# Altium project Base_logic_gate.PrjPcb
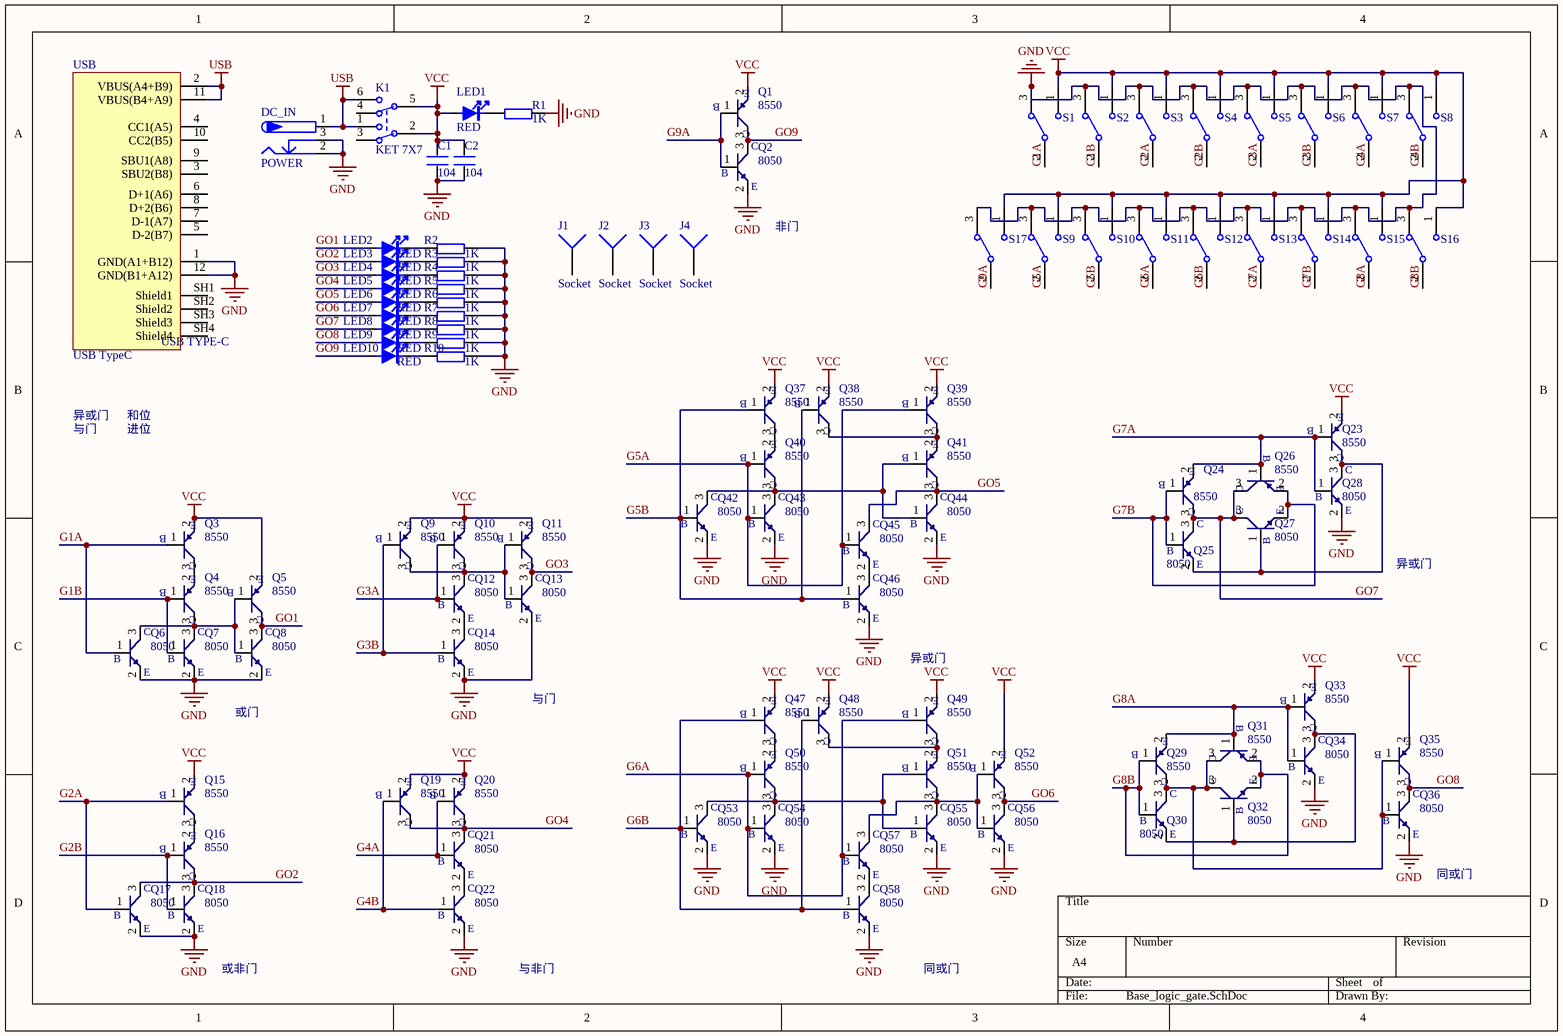
[diagram p0: Base_logic_gate.SchDoc]
1 sheet, 104 parts. Net scope: global (net labels, ports and power ports of the same name join across sheets).
Board file: Base_logic_gate.PcbDoc

## Sheet Base_logic_gate.SchDoc
size A4

### Parts
C1  104  [C 0603_L]
C2  104  [C 0603_L]
DC_IN  POWER  [DC-005]
J1  Socket  [M3]
J2  Socket  [M3]
J3  Socket  [M3]
J4  Socket  [M3]
K1  KET 7X7  [KFT DIP-8X8]
LED1  RED  [LED 0603B]
LED2  RED  [LED 0603B]
LED3  RED  [LED 0603B]
LED4  RED  [LED 0603B]
LED5  RED  [LED 0603B]
LED6  RED  [LED 0603B]
LED7  RED  [LED 0603B]
LED8  RED  [LED 0603B]
LED9  RED  [LED 0603B]
LED10  RED  [LED 0603B]
Q1  8550  [SOT23-3L]
Q2  8050  [SOT23-3L]
Q3  8550  [SOT23-3L]
Q4  8550  [SOT23-3L]
Q5  8550  [SOT23-3L]
Q6  8050  [SOT23-3L]
Q7  8050  [SOT23-3L]
Q8  8050  [SOT23-3L]
Q9  8550  [SOT23-3L]
Q10  8550  [SOT23-3L]
Q11  8550  [SOT23-3L]
Q12  8050  [SOT23-3L]
Q13  8050  [SOT23-3L]
Q14  8050  [SOT23-3L]
Q15  8550  [SOT23-3L]
Q16  8550  [SOT23-3L]
Q17  8050  [SOT23-3L]
Q18  8050  [SOT23-3L]
Q19  8550  [SOT23-3L]
Q20  8550  [SOT23-3L]
Q21  8050  [SOT23-3L]
Q22  8050  [SOT23-3L]
Q23  8550  [SOT23-3L]
Q24  8550  [SOT23-3L]
Q25  8050  [SOT23-3L]
Q26  8550  [SOT23-3L]
Q27  8050  [SOT23-3L]
Q28  8050  [SOT23-3L]
Q29  8550  [SOT23-3L]
Q30  8050  [SOT23-3L]
Q31  8550  [SOT23-3L]
Q32  8050  [SOT23-3L]
Q33  8550  [SOT23-3L]
Q34  8050  [SOT23-3L]
Q35  8550  [SOT23-3L]
Q36  8050  [SOT23-3L]
Q37  8550  [SOT23-3L]
Q38  8550  [SOT23-3L]
Q39  8550  [SOT23-3L]
Q40  8550  [SOT23-3L]
Q41  8550  [SOT23-3L]
Q42  8050  [SOT23-3L]
Q43  8050  [SOT23-3L]
Q44  8050  [SOT23-3L]
Q45  8050  [SOT23-3L]
Q46  8050  [SOT23-3L]
Q47  8550  [SOT23-3L]
Q48  8550  [SOT23-3L]
Q49  8550  [SOT23-3L]
Q50  8550  [SOT23-3L]
Q51  8550  [SOT23-3L]
Q52  8550  [SOT23-3L]
Q53  8050  [SOT23-3L]
Q54  8050  [SOT23-3L]
Q55  8050  [SOT23-3L]
Q56  8050  [SOT23-3L]
Q57  8050  [SOT23-3L]
Q58  8050  [SOT23-3L]
R1  1K  [R 0603_L]
R2  1K  [R 0603_L]
R3  1K  [R 0603_L]
R4  1K  [R 0603_L]
R5  1K  [R 0603_L]
R6  1K  [R 0603_L]
R7  1K  [R 0603_L]
R8  1K  [R 0603_L]
R9  1K  [R 0603_L]
R10  1K  [R 0603_L]
S1  BUTTON_DIP3  [BTN8.8*4.6]  (value not drawn)
S2  BUTTON_DIP3  [BTN8.8*4.6]  (value not drawn)
S3  BUTTON_DIP3  [BTN8.8*4.6]  (value not drawn)
S4  BUTTON_DIP3  [BTN8.8*4.6]  (value not drawn)
S5  BUTTON_DIP3  [BTN8.8*4.6]  (value not drawn)
S6  BUTTON_DIP3  [BTN8.8*4.6]  (value not drawn)
S7  BUTTON_DIP3  [BTN8.8*4.6]  (value not drawn)
S8  BUTTON_DIP3  [BTN8.8*4.6]  (value not drawn)
S9  BUTTON_DIP3  [BTN8.8*4.6]  (value not drawn)
S10  BUTTON_DIP3  [BTN8.8*4.6]  (value not drawn)
S11  BUTTON_DIP3  [BTN8.8*4.6]  (value not drawn)
S12  BUTTON_DIP3  [BTN8.8*4.6]  (value not drawn)
S13  BUTTON_DIP3  [BTN8.8*4.6]  (value not drawn)
S14  BUTTON_DIP3  [BTN8.8*4.6]  (value not drawn)
S15  BUTTON_DIP3  [BTN8.8*4.6]  (value not drawn)
S16  BUTTON_DIP3  [BTN8.8*4.6]  (value not drawn)
S17  BUTTON_DIP3  [BTN8.8*4.6]  (value not drawn)
USB  USB TypeC  [USB Type-C]

### Nets
GND: C1.1 C2.1 DC_IN.2 DC_IN.3 Q2.2(E) Q6.2(E) Q7.2(E) Q8.2(E) Q13.2(E) Q14.2(E) Q17.2(E) Q18.2(E) Q22.2(E) Q28.2(E) Q34.2(E) Q36.2(E) Q42.2(E) Q43.2(E) Q44.2(E) Q46.2(E) Q53.2(E) Q54.2(E) Q55.2(E) Q56.2(E) Q58.2(E) R1.2 R2.2 R3.2 R4.2 R5.2 R6.2 R7.2 R8.2 R9.2 R10.2 S1.3 S2.3 S3.3 S4.3 S5.3 S6.3 S7.3 S8.3 S9.3 S10.3 S11.3 S12.3 S13.3 S14.3 S15.3 S16.3 S17.3 USB.1(GND(A1+B12)) USB.12(GND(B1+A12))
USB: DC_IN.1 K1.1(NC1) K1.6(NC2) USB.2(VBUS(A4+B9)) USB.11(VBUS(B4+A9))
VCC: C1.2 C2.2 K1.2(COM1) K1.5(COM2) LED1.1 Q1.2(E) Q3.2(E) Q5.2(E) Q9.2(E) Q10.2(E) Q11.2(E) Q15.2(E) Q19.2(E) Q20.2(E) Q23.2(E) Q33.2(E) Q35.2(E) Q37.2(E) Q38.2(E) Q39.2(E) Q47.2(E) Q48.2(E) Q49.2(E) Q52.2(E) S1.1 S2.1 S3.1 S4.1 S5.1 S6.1 S7.1 S8.1 S9.1 S10.1 S11.1 S12.1 S13.1 S14.1 S15.1 S16.1 S17.1
G1A: Q3.1(B) Q6.1(B) S1.2
G1B: Q4.1(B) Q7.1(B) S2.2
G2A: Q15.1(B) Q17.1(B) S3.2
G2B: Q16.1(B) Q18.1(B) S4.2
G3A: Q10.1(B) Q12.1(B) S5.2
G3B: Q9.1(B) Q14.1(B) S6.2
G4A: Q20.1(B) Q21.1(B) S7.2
G4B: Q19.1(B) Q22.1(B) S8.2
G5A: Q39.1(B) Q40.1(B) Q43.1(B) Q45.1(B) S9.2
G5B: Q37.1(B) Q38.1(B) Q42.1(B) Q46.1(B) S10.2
G6A: Q49.1(B) Q50.1(B) Q54.1(B) Q57.1(B) S11.2
G6B: Q47.1(B) Q48.1(B) Q53.1(B) Q58.1(B) S12.2
G7A: Q23.1(B) Q24.2(E) Q26.1(B) Q28.1(B) S13.2
G7B: Q24.1(B) Q25.1(B) Q26.2(E) Q27.2(E) S14.2
G8A: Q29.2(E) Q31.1(B) Q33.1(B) Q34.1(B) S15.2
G8B: Q29.1(B) Q30.1(B) Q31.2(E) Q32.2(E) S16.2
G9A: Q1.1(B) Q2.1(B) S17.2
GO1: LED2.1 Q5.3(C) Q8.3(C)
GO2: LED3.1 Q16.3(C) Q17.3(C) Q18.3(C)
GO3: LED4.1 Q11.3(C) Q13.3(C)
GO4: LED5.1 Q19.3(C) Q20.3(C) Q21.3(C)
GO5: LED6.1 Q41.3(C) Q44.3(C) Q45.3(C)
GO6: LED7.1 Q52.3(C) Q56.3(C)
GO7: LED8.1 Q24.3(C) Q25.3(C) Q26.3(C) Q27.3(C)
GO8: LED9.1 Q35.3(C) Q36.3(C)
GO9: LED10.1 Q1.3(C) Q2.3(C)
NetLED1_2: LED1.2 R1.1
NetLED2_2: LED2.2 R2.1
NetLED3_2: LED3.2 R3.1
NetLED4_2: LED4.2 R4.1
NetLED5_2: LED5.2 R5.1
NetLED6_2: LED6.2 R6.1
NetLED7_2: LED7.2 R7.1
NetLED8_2: LED8.2 R8.1
NetLED9_2: LED9.2 R9.1
NetLED10_2: LED10.2 R10.1
NetQ3_3: Q3.3(C) Q4.2(E)
NetQ4_3: Q4.3(C) Q5.1(B) Q6.3(C) Q7.3(C) Q8.1(B)
NetQ9_3: Q9.3(C) Q10.3(C) Q11.1(B) Q12.3(C) Q13.1(B)
NetQ12_2: Q12.2(E) Q14.3(C)
NetQ15_3: Q15.3(C) Q16.2(E)
NetQ21_2: Q21.2(E) Q22.3(C)
NetQ23_3: Q23.3(C) Q25.2(E) Q27.1(B) Q28.3(C)
NetQ29_3: Q29.3(C) Q30.3(C) Q31.3(C) Q32.3(C) Q35.1(B) Q36.1(B)
NetQ30_2: Q30.2(E) Q32.1(B) Q33.3(C) Q34.3(C)
NetQ37_3: Q37.3(C) Q40.2(E)
NetQ38_3: Q38.3(C) Q39.3(C) Q41.2(E)
NetQ40_3: Q40.3(C) Q41.1(B) Q42.3(C) Q43.3(C) Q44.1(B)
NetQ45_2: Q45.2(E) Q46.3(C)
NetQ47_3: Q47.3(C) Q50.2(E)
NetQ48_3: Q48.3(C) Q49.3(C) Q51.2(E)
NetQ50_3: Q50.3(C) Q51.1(B) Q53.3(C) Q54.3(C) Q55.1(B)
NetQ51_3: Q51.3(C) Q52.1(B) Q55.3(C) Q56.1(B) Q57.3(C)
NetQ57_2: Q57.2(E) Q58.3(C)

Not connected (* = marked no-connect by the designer): J1 1; J2 1; J3 1; J4 1; K1 3(NO1) 4(NO2); USB 3(SBU2(B8)) 4(CC1(A5)) 5(D-2(B7)) 6(D+1(A6)) 7(D-1(A7)) 8(D+2(B6)) 9(SBU1(A8)) 10(CC2(B5)) SH1(Shield1) SH2(Shield2) SH3(Shield3) SH4(Shield4)

### Notes on the sheet
- (near Q2) 非门
- 异或门
- 与门
- 和位
- 进位
- 或门
- (near Q36) 同或门
- (near Q18) 或非门
- 与非门
- 同或门
- (in symbol USB 2.0 Type C) USB TYPE-C

### Library data of the parts
C1 C2 = C
DC_IN = P-DC: 低压电源接口; BOM名称: DC电源接口; 版权归属: 源创客; 学习资源: www.ooocke.com
K1 = KET 7X7: 7*7自锁开关; 版权归属: 正点原子; Parameter: 按键/开关; BOM名称: 7*7自锁开关; 学习资源: www.openedv.com
LED1-LED10 = LED: 发光二极管
Q1 Q3-Q5 Q9-Q11 Q15 Q16 Q19 Q20 Q23 Q24 Q26 Q29 Q31 Q33 Q35 Q37-Q41 Q47-Q52 = 8550PNP
Q2 Q6-Q8 Q12-Q14 Q17 Q18 Q21 Q22 Q25 Q27 Q28 Q30 Q32 Q34 Q36 Q42-Q46 Q53-Q58 = 8050NPN
R1-R10 = R
S1-S17 = SW-SPDT: SPDT Subminiature Toggle Switch, Right Angle Mounting, Vertical Actuation; Published: 24-Mar-1999; LatestRevisionDate: 17-Dec-2003; LatestRevisionNote: Schematic revised, PCB Footprint replaced.; DatasheetVersion: 05-Dec-2000; PackageReference: TL36WW15050; Publisher: Altium Limited; PackageDescription: Switch; 4 Leads; ComponentLink1Description: Manufacturer Link; ComponentLink1URL: http://www.apem.com
USB = USB 2.0 Type C: 12P TypeC 母座; 版权归属: 正点原子; Parameter: 接口器件; 学习资源: www.openedv.com
J1-J4 = Socket: LatestRevisionDate: 17-Jul-2002; LatestRevisionNote: Re-released for DXP Platform.; Publisher: Altium Limited